# EAGLE design dronestandfinal (EAGLE 9.3.2)
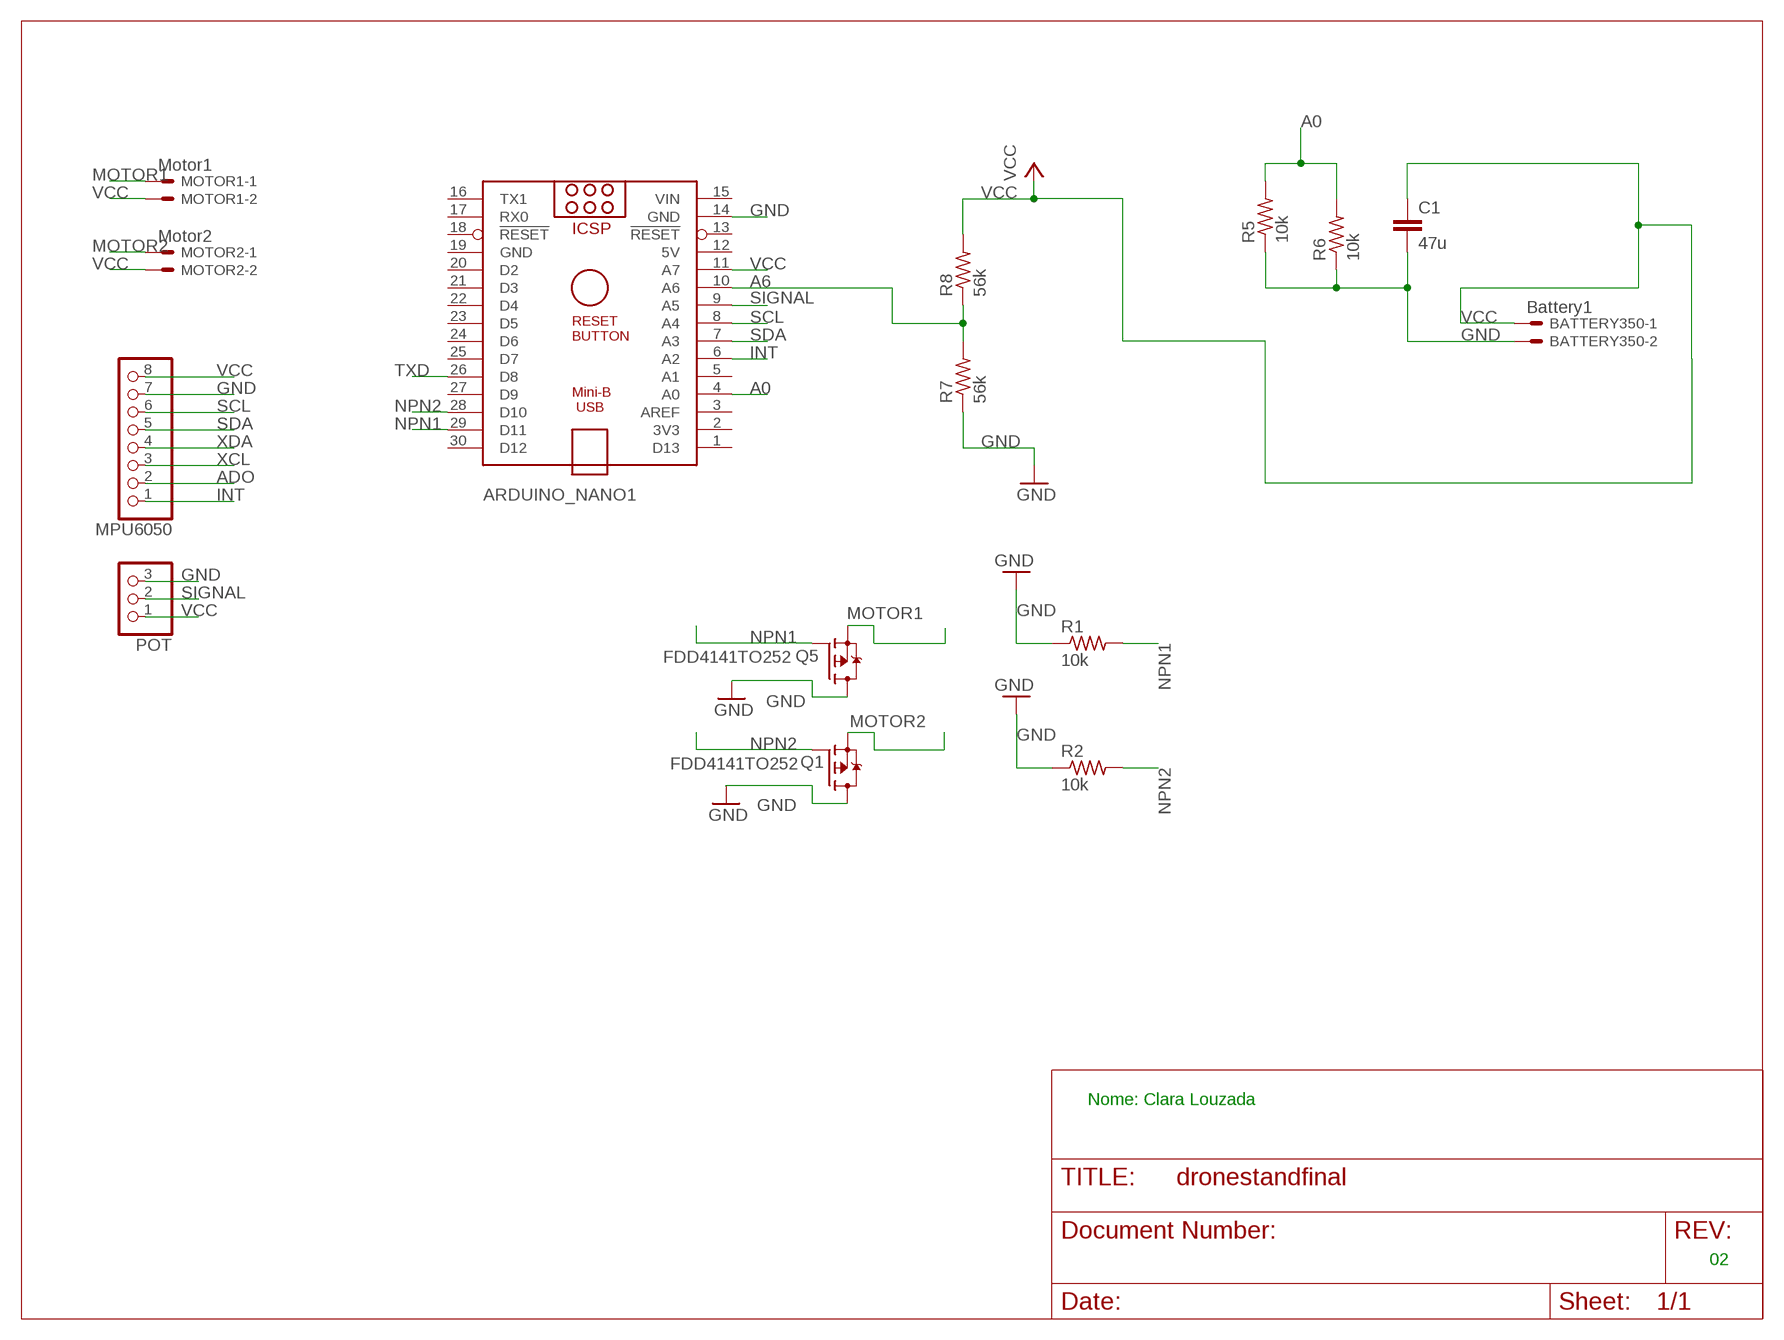
[diagram p0: schematic, sheet 1]

## Parts
ARDUINO_NANO1  ARDUINO_NANO  [ARDUINO_NANO]
BATTERY350  Battery1  JST-XH-02-PIN-LONG-PAD  [JST-XH-02-PACKAGE-LONG-PAD]
C1  47u  C2,5-3  [C2.5-3]
MOTOR1  Motor1  JST-XH-02-PIN-LONG-PAD  [JST-XH-02-PACKAGE-LONG-PAD]
MOTOR2  Motor2  JST-XH-02-PIN-LONG-PAD  [JST-XH-02-PACKAGE-LONG-PAD]
MPU6050  PINHD-1X8  [1X08]
POT  PINHD-1X3  [1X03]
Q1  FDD4141TO252  [TO252]
Q5  FDD4141TO252  [TO252]
R1  10k  R-US_0204/7  [0204/7]
R2  10k  R-US_0204/7  [0204/7]
R5  10k  R-US_0204/7  [0204/7]
R6  10k  R-US_0204/7  [0204/7]
R7  56k  R-US_0204/7  [0204/7]
R8  56k  R-US_0204/7  [0204/7]

## Nets
A0: ARDUINO_NANO1.4(A0) R5.2 R6.2
A6: ARDUINO_NANO1.10(A6) R7.2 R8.1
ADO: MPU6050.2
GND: ARDUINO_NANO1.14(GND) BATTERY350.2 C1.2 MPU6050.7 POT.3 Q1.3(D) Q5.3(D) R1.1 R2.1 R5.1 R6.1 R7.1
INT: ARDUINO_NANO1.6(A2) MPU6050.1
MOTOR1: MOTOR1.1 Q5.2(S)
MOTOR2: MOTOR2.1 Q1.2(S)
NPN1: ARDUINO_NANO1.29(D11) Q5.1(G) R1.2
NPN2: ARDUINO_NANO1.28(D10) Q1.1(G) R2.2
SCL: ARDUINO_NANO1.8(A4) MPU6050.6
SDA: ARDUINO_NANO1.7(A3) MPU6050.5
SIGNAL: ARDUINO_NANO1.9(A5) POT.2
TXD: ARDUINO_NANO1.26(D8)
VCC: ARDUINO_NANO1.11(A7) BATTERY350.1 C1.1 MOTOR1.2 MOTOR2.2 MPU6050.8 POT.1 R8.2
XCL: MPU6050.3
XDA: MPU6050.4
Unconnected: ARDUINO_NANO1.1(D13) ARDUINO_NANO1.2(3V3) ARDUINO_NANO1.3(AREF) ARDUINO_NANO1.5(A1) ARDUINO_NANO1.13(!RESET) ARDUINO_NANO1.16(TX1) ARDUINO_NANO1.17(RX0) ARDUINO_NANO1.18(!RESET) ARDUINO_NANO1.20(D2) ARDUINO_NANO1.21(D3) ARDUINO_NANO1.22(D4) ARDUINO_NANO1.23(D5) ARDUINO_NANO1.24(D6) ARDUINO_NANO1.25(D7) ARDUINO_NANO1.27(D9) ARDUINO_NANO1.30(D12)

## Notes on the sheet
- Nome: Clara Louzada
- 02

## Power pins joined to a net without a drawn wire
5V: ARDUINO_NANO1.12(5V)
GND: ARDUINO_NANO1.19(GND)
VIN: ARDUINO_NANO1.15(VIN)

## Library data of the parts
ARDUINO_NANO1 = ArduinoNanoV30:ARDUINO_NANO: Arduino Nano V3.0 Overview: The Arduino Nano is a small, complete, and breadboard-friendly board based on the ATmega328 (Arduino Nano 3.x) or ATmega168 (Arduino Nano 2.x). It has more or less the same functionality of the Arduino Duemilanove, but in a different package. It lacks only a DC power jack, and works with a Mini-B USB cable instead of a standard one. The Nano was designed and is being produced by Gravitech. Specifications: Microcontroller Atmel ATmega168 or ATmega328 Operating Voltage (logic level) 5 V Input Voltage (recommended) 7-12 V Input Voltage (limits) 6-20 V Digital I/O Pins 14 (of which 6 provide PWM output) Analog Input Pins 8 DC Current per I/O Pin 40 mA Flash Memory 16 KB (ATmega168) or 32 KB (ATmega328) of which 2 KB used by bootloader SRAM 1 KB (ATmega168) or 2 KB (ATmega328) EEPROM 512 bytes (ATmega168) or 1 KB (ATmega328) Clock Speed 16 MHz Dimensions 0.73" x 1.70" Length 45 mm Width 18 mm Weigth 5 g Power: The Arduino Nano can be powered via the Mini-B USB connection, 6-20V unregulated external power supply (pin 30), or 5V regulated external power supply (pin 27). The power source is automatically selected to the highest voltage source. Memory: The ATmega168 has 16 KB of flash memory for storing code (of which 2 KB is used for the bootloader); the ATmega328 has 32 KB, (also with 2 KB used for the bootloader). The ATmega168 has 1 KB of SRAM and 512 bytes of EEPROM (which can be read and written with the EEPROM library); the ATmega328 has 2 KB of SRAM and 1 KB of EEPROM. Input and Output: Each of the 14 digital pins on the Nano can be used as an input or output, using pinMode(), digitalWrite(), and digitalRead() functions. They operate at 5 volts. Each pin can provide or receive a maximum of 40 mA and has an internal pull-up resistor (disconnected by default) of 20-50 kOhms. In addition, some pins have specialized functions. Visit Arduino - ArduinoBoardNano <https://www.arduino.cc/en/Main/ArduinoBoardNano>
BATTERY350 MOTOR1 MOTOR2 = Rembrandt Electronics - JST XH Connectors v1-0:JST-XH-02-PIN: JST XH Connector 2 Pin Wire to board connector. Pitch: 2,54 mm, (0.100") Number of pins: 2 Created by Rembrandt Electronics www.rembrandtelectronics.com
C1 = capacitor-wima:C: CAPACITOR naming: grid - package width
MPU6050 = pinhead:PINHD-1X8: PIN HEADER
POT = pinhead:PINHD-1X3: PIN HEADER
Q1 Q5 = transistor-fet:FDD4141: P-Channel PowerTrench® MOSFET Source: FDD4141.pdf
R1 R2 R5-R8 = resistor:R-US_: RESISTOR, American symbol

## Board
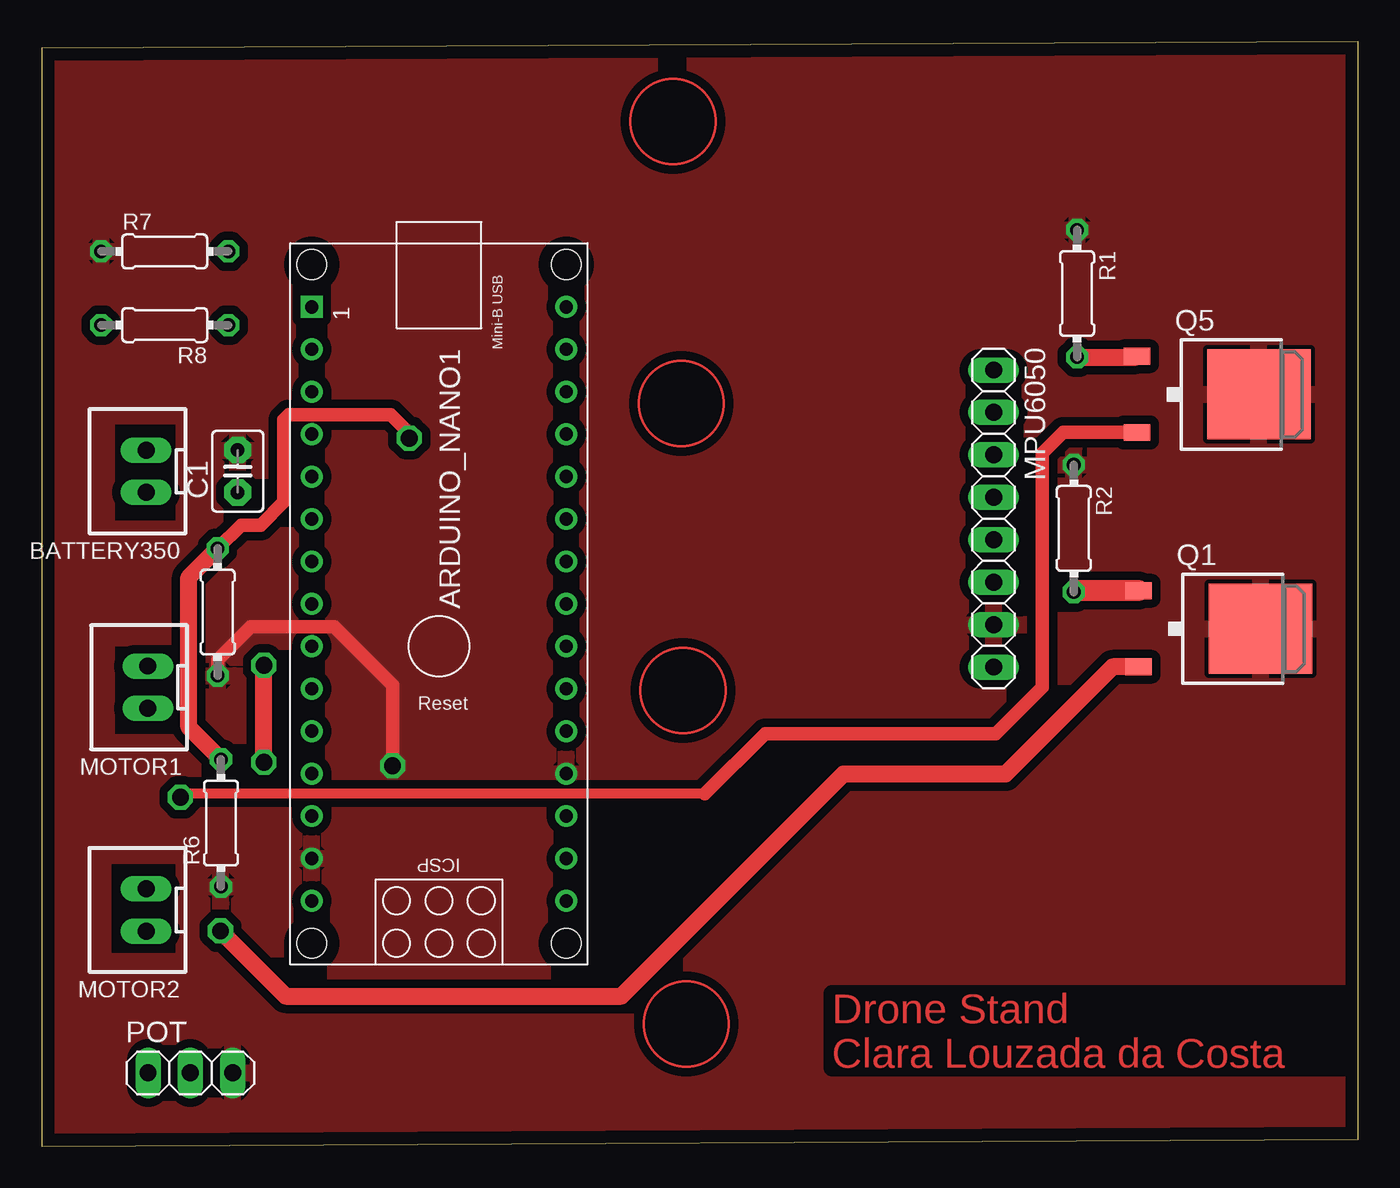
[diagram p1: board, top side]
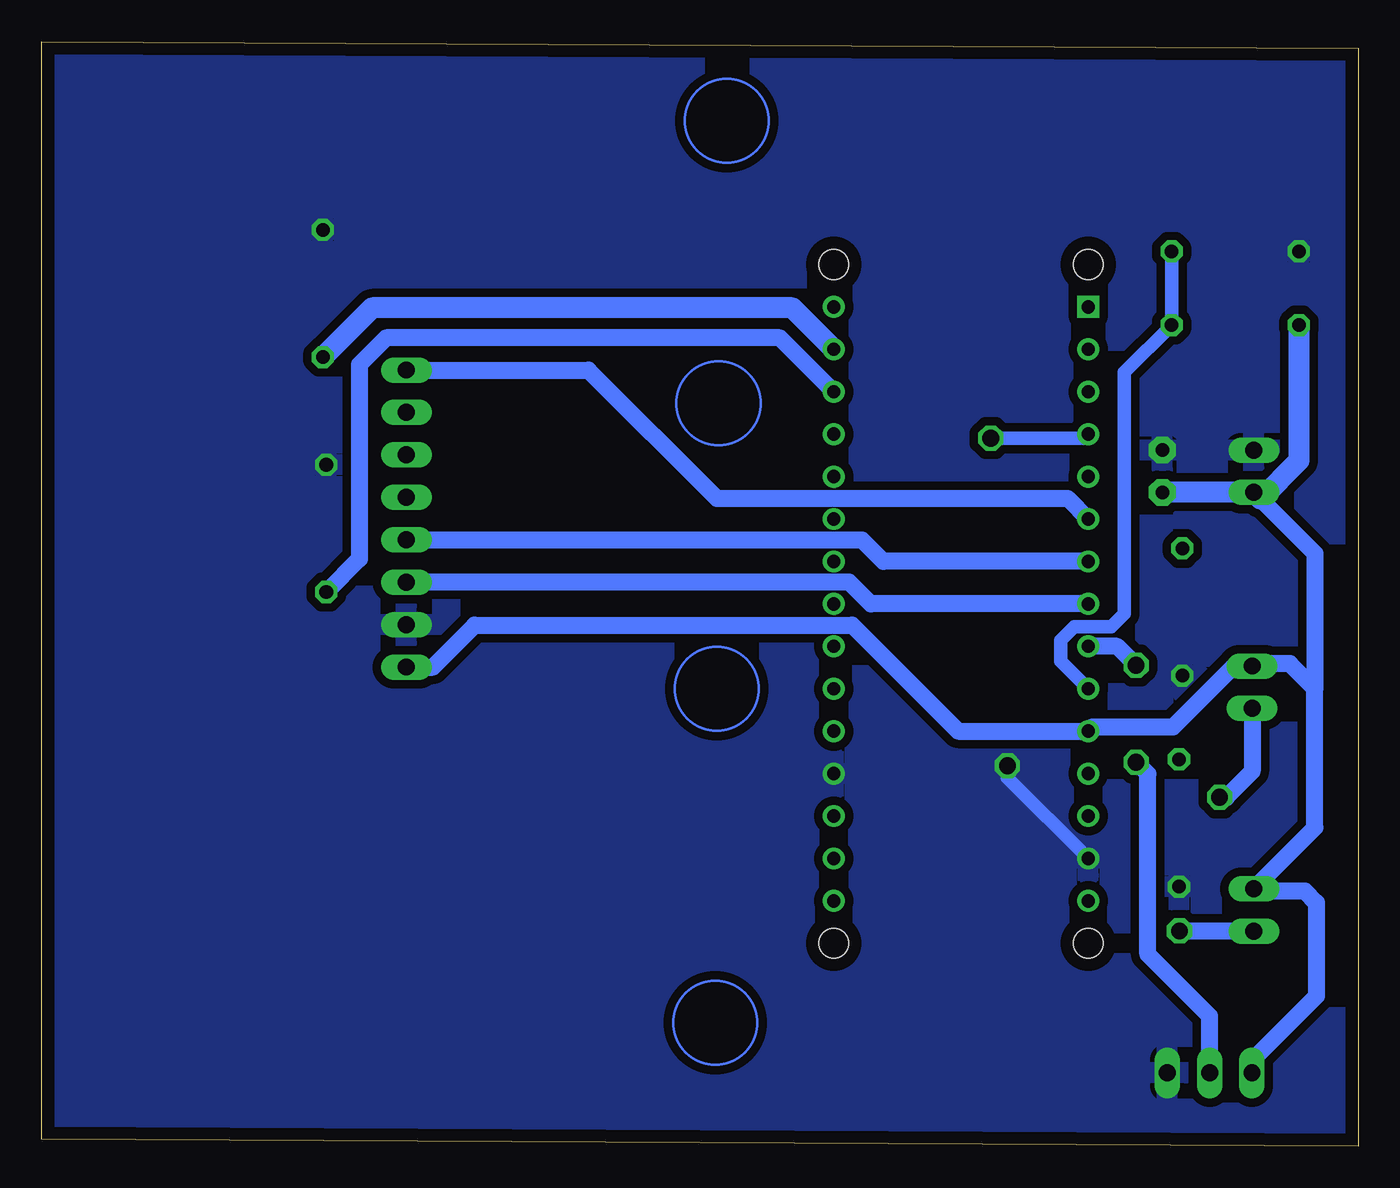
[diagram p2: board, bottom side, seen from below]

Size 78.81 x 66.11 mm. Coordinates in mm from the lower left corner, seen from the top.
Outline: 0,0 78.81,0.4 78.81,66.11 0,65.71 0,0
Copper layers (1*16): Top 0.035mm / dielectric 1.5mm / Bottom 0.035mm
Design rules "default *": minimum track width 6mil, minimum drill 1mm, track to track 20mil, track to pad 20mil, pad to pad 20mil, via to via 25mil, smd to smd 6mil, copper to edge 30mil, drill to drill 1mm, minimum pad ring 10mil, minimum via ring 8mil, stop-mask expansion 4mil, vias tented up to drill 0mil, thermal gap 10mil
tRestrict: area 4.2,11.6 to 8,16.9; area 4.4,24.7 to 8,29.9; area 4.4,37.5 to 8,43.2; area 5.5,3.3 to 11.9,4.9

### Footprints (pad centres in the part's own frame; a part is rotated, then mirrored left to right if it is on the bottom)
ARDUINO_NANO = drill 0.8 square: 1 -20.32,-7.62 | drill 0.8: 2 -17.78,-7.62; 3 -15.24,-7.62; 4 -12.7,-7.62; 5 -10.16,-7.62; 6 -7.62,-7.62; 7 -5.08,-7.62; 8 -2.54,-7.62; 9 0,-7.62; 10 2.54,-7.62; 11 5.08,-7.62; 12 7.62,-7.62; 13 10.16,-7.62; 14 12.7,-7.62; 15 15.24,-7.62; 16 15.24,7.62; 17 12.7,7.62; 18 10.16,7.62; 19 7.62,7.62; 20 5.08,7.62; 21 2.54,7.62; 22 0,7.62; 23 -2.54,7.62; 24 -5.08,7.62; 25 -7.62,7.62; 26 -10.16,7.62; 27 -12.7,7.62; 28 -15.24,7.62; 29 -17.78,7.62; 30 -20.32,7.62 | hole 1.778: -22.86,-7.62; -22.86,7.62; 17.78,7.62; 17.78,-7.62
JST-XH-02-PACKAGE-LONG-PAD = drill 1.016 long: 1 -1.27,0; 2 1.27,0
C2.5-3 = drill 0.813 pad 1.6 octagon: 1 -1.27,0; 2 1.27,0
1X08 = drill 1.016 long: 1 -8.89,0; 2 -6.35,0; 3 -3.81,0; 4 -1.27,0; 5 1.27,0; 6 3.81,0; 7 6.35,0; 8 8.89,0
1X03 = drill 1.016 long: 1 -2.54,0; 2 0,0; 3 2.54,0
TO252 = smd 1 x 1.6: 1 -2.28,-4.8; 2 2.28,-4.8 | smd 5.4 x 6.2: 3 0,2.5
0204/7 = drill 0.813 octagon: 1 -3.81,0; 2 3.81,0

### Placement (x,y rotation side)
ARDUINO_NANO1  23.78,29.92 270 top
BATTERY350  6.25,40.4 90 top
C1  11.73,40.4 90 top
MOTOR1  6.35,27.47 90 top
MOTOR2  6.25,14.14 90 top
MPU6050  56.98,37.57 270 top
POT  8.9,4.38 0 top
Q1  70.46,30.97 270 top
Q5  70.36,45 270 top
R1  61.98,51.04 270 top
R2  61.78,36.98 270 top
R5  10.53,31.97 90 top
R6  10.73,19.34 90 top
R7  7.36,53.56 0 top
R8  7.36,49.15 180 top

### Tracks (layer width: path | path; a pad name or v marks a point on that pad's centre or on a via)
A0  (via drill 1)
  Top 0.813: R5.2 11.93,37.18 13.1,37.18 14.5,38.58 14.5,43.48 14.8,43.78 20.9,43.78 22,42.68 v22,42.38
  Top 1.016: R6.2 8.8,25.08 8.8,34.05 R5.2
  Bottom 0.813: v22,42.38 16.4,42.38 ARDUINO_NANO1.4
A6
  Bottom 0.813: R7.2 R8.1 14,46.32 14,31.88 14.8,31.08 17,31.08 17.8,30.28 17.8,29.02 ARDUINO_NANO1.10
GND  (via drill 1)
  Top 0.813: v21,22.77 21,27.58 17.5,31.08 12.5,31.08 10.53,29.11 R5.1
  Bottom 0.813: ARDUINO_NANO1.14 21,22.06 v21,22.77
  pour Top: 0.3,65.68 78.4,65.68 78.4,-0.02 0.2,-0.02 0.1,0.08 0.1,65.78
  pour Bottom: 0.3,65.58 78.7,65.58 78.7,0.18 0.3,0.18 0.2,0.28 0.2,65.48
INT
  Bottom 1.016: MPU6050.1 46.08,46.46 38.4,38.78 17.4,38.78 ARDUINO_NANO1.6
MOTOR1  (via drill 1)
  Top 0.61: 39.7,21.08 8.5,21.08
  Top 0.813: Q5.2 61.14,42.72 59.9,41.48 59.9,27.48 57.1,24.68 43.3,24.68 39.7,21.08 | 8.5,21.08 v8.3,20.88
  Bottom 1.016: MOTOR1.1 6.35,22.43 7.9,20.88 v8.3,20.88
MOTOR2  (via drill 1)
  Top 1.016: v10.7,12.88 14.6,8.98 34.7,8.98 48,22.28 57.7,22.28 64.11,28.69 Q1.2
  Bottom 1.016: MOTOR2.1 v10.69,12.87 v10.7,12.88
NPN1
  Top 1.016: R1.2 65.51,47.23 Q5.1
  Bottom 1.27: ARDUINO_NANO1.29 33.88,50.18 59.03,50.18 R1.2
NPN2
  Top 1.27: Q1.1 61.86,33.25 R2.2
  Bottom 1.016: ARDUINO_NANO1.28 34.62,48.38 58.2,48.38 59.8,46.78 59.8,35.15 R2.2
SCL
  Bottom 1.016: ARDUINO_NANO1.8 29.18,32.46 30.48,33.76 MPU6050.6
SDA
  Bottom 1.016: ARDUINO_NANO1.7 28.42,35 29.7,36.28 56.96,36.28 MPU6050.5
SIGNAL  (via drill 1)
  Top 1.016: v13.3,22.98 v13.3,28.78
  Bottom 1.016: POT.2 8.9,7.78 12.6,11.48 12.6,22.28 v13.3,22.98 | v13.3,28.78 14.44,29.92 ARDUINO_NANO1.9
VCC
  Bottom 1.016: MPU6050.8 55.4,28.68 52.9,31.18 30.3,31.18 23.96,24.84 ARDUINO_NANO1.11 15.92,25.08 11.1,25.08 7.44,28.74 MOTOR1.2 6.21,28.88 4.1,28.88 2.6,27.38 | POT.1 6.36,5.12 2.5,8.98 2.5,14.58 3.2,15.28 6.12,15.28 MOTOR2.2 2.6,19.06 2.6,27.38 | BATTERY350.1 5.85,38.73 2.6,35.48 2.6,27.38
  Bottom 1.27: BATTERY350.1 C1.1 | R8.2 3.55,41.03 5.85,38.73
(copper drawn outside any net)
  shapes: Bottom circle x4, Top circle x4

### Text on the board
Top: Drone Stand / Clara Louzada da Costa